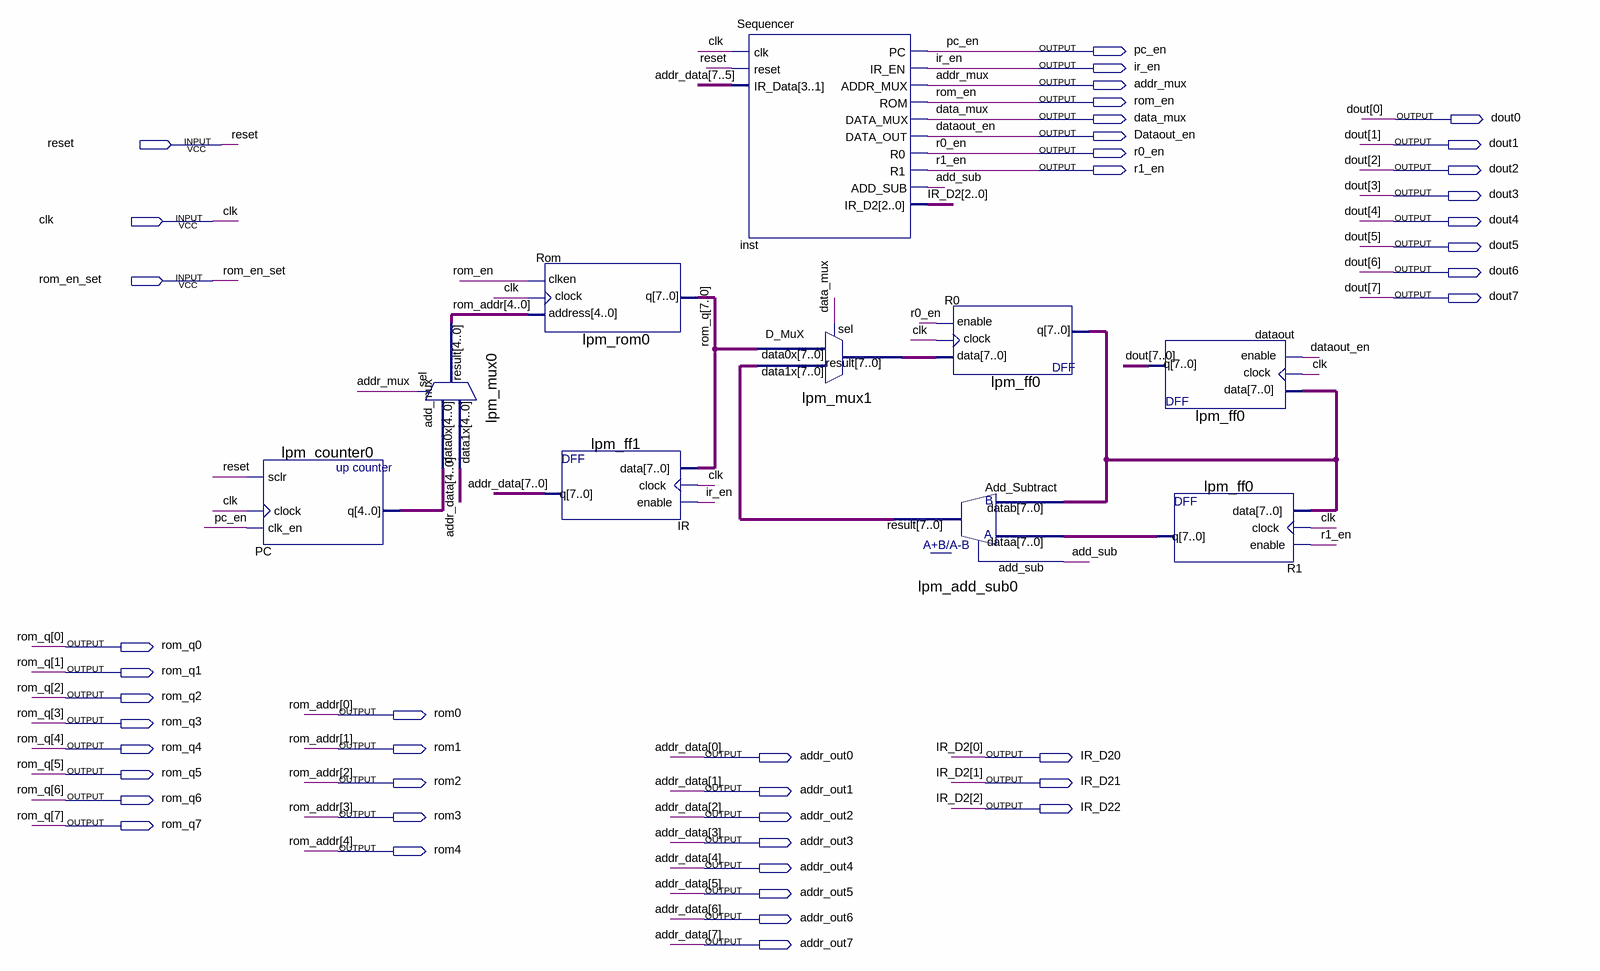
[diagram p0: schematic sheet]
// Quartus schematic Processor.bdf as structural Verilog: 10 symbols, 43 pins
module Processor (
  input  reset,
  input  clk,
  input  rom_en_set,
  output pc_en,
  output ir_en,
  output addr_mux,
  output rom_en,
  output data_mux,
  output dout0,
  output Dataout_en,
  output dout1,
  output r0_en,
  output r1_en,
  output dout2,
  output dout3,
  output dout4,
  output dout5,
  output dout6,
  output dout7,
  output rom_q0,
  output rom_q1,
  output rom_q2,
  output rom0,
  output rom_q3,
  output rom_q4,
  output rom1,
  output addr_out0,
  output IR_D20,
  output rom_q5,
  output rom2,
  output IR_D21,
  output addr_out1,
  output rom_q6,
  output IR_D22,
  output rom3,
  output addr_out2,
  output rom_q7,
  output addr_out3,
  output rom4,
  output addr_out4,
  output addr_out5,
  output addr_out6,
  output addr_out7
);

  wire add_sub;
  wire [4:0] PC_q;
  wire [7:0] Add_Subtract_result, D_MuX_result, R0_q, R1_q;

  lpm_counter0 PC (.sclr(reset), .clock(clk), .clk_en(pc_en), .q(PC_q));
  lpm_mux0 add_mux (
    .data1x({addr_out4, addr_out3, addr_out2, addr_out1, addr_out0}), .data0x(PC_q), .sel(addr_mux),
    .result({rom4, rom3, rom2, rom1, rom0}));
  lpm_rom0 Rom (
    .address({rom4, rom3, rom2, rom1, rom0}), .clock(clk), .clken(rom_en),
    .q({rom_q7, rom_q6, rom_q5, rom_q4, rom_q3, rom_q2, rom_q1, rom_q0}));
  lpm_ff1 IR (
    .data({rom_q7, rom_q6, rom_q5, rom_q4, rom_q3, rom_q2, rom_q1, rom_q0}), .clock(clk), .enable(ir_en),
    .q({addr_out7, addr_out6, addr_out5, addr_out4, addr_out3, addr_out2, addr_out1, addr_out0}));
  Sequencer inst (
    .clk(clk), .reset(reset), .IR_Data({addr_out7, addr_out6, addr_out5}), .PC(pc_en), .IR_EN(ir_en),
    .ADDR_MUX(addr_mux), .ROM(rom_en), .DATA_MUX(data_mux), .DATA_OUT(Dataout_en), .R0(r0_en), .R1(r1_en),
    .ADD_SUB(add_sub), .IR_D2({IR_D22, IR_D21, IR_D20}));
  lpm_mux1 D_MuX (
    .data1x(Add_Subtract_result), .data0x({rom_q7, rom_q6, rom_q5, rom_q4, rom_q3, rom_q2, rom_q1, rom_q0}),
    .sel(data_mux), .result(D_MuX_result));
  lpm_add_sub0 Add_Subtract (.dataa(R1_q), .datab(R0_q), .add_sub(add_sub), .result(Add_Subtract_result));
  lpm_ff0 R0 (.data(D_MuX_result), .clock(clk), .enable(r0_en), .q(R0_q));
  lpm_ff0 dataout (
    .data(R0_q), .clock(clk), .enable(Dataout_en),
    .q({dout7, dout6, dout5, dout4, dout3, dout2, dout1, dout0}));
  lpm_ff0 R1 (.data(R0_q), .clock(clk), .enable(r1_en), .q(R1_q));

  // Other names for the same wires on the sheet: addr_data[7:0] = {addr_out7, addr_out6, addr_out5, addr_out4, addr_out3, addr_out2, addr_out1, addr_out0};
  //   rom_addr[4:0] = {rom4, rom3, rom2, rom1, rom0}
endmodule
